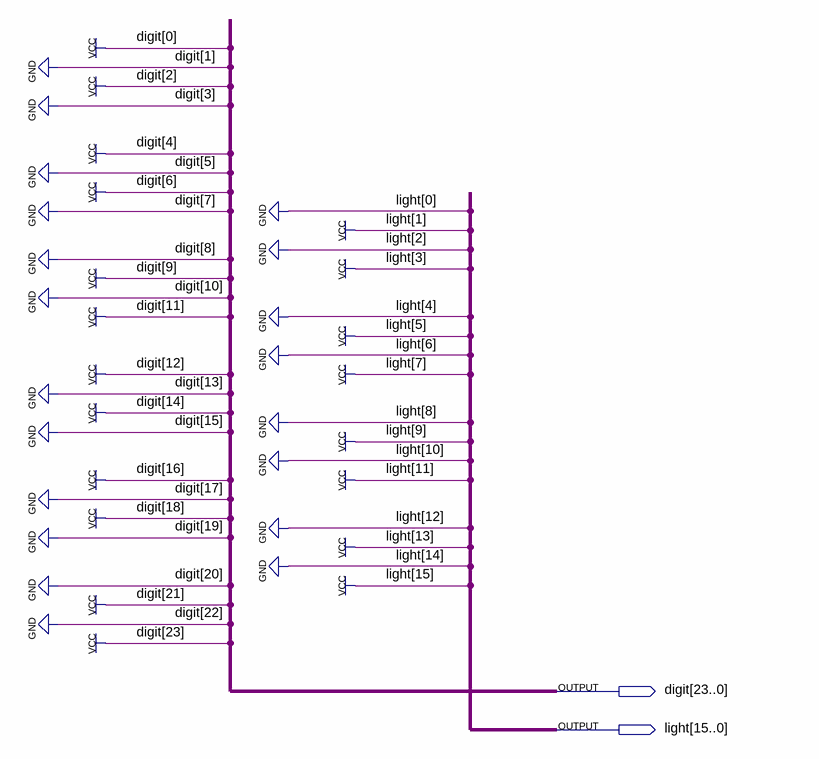
[diagram p0: schematic sheet]
// Quartus schematic Pattern_0_Frame_7.bdf as structural Verilog: 0 symbols, 2 pins
module Pattern_0_Frame_7 (
  output [23:0] digit,
  output [15:0] light
);


  assign digit = 24'b101001010101101001010101;
  assign light = 16'b1010101010101010;
endmodule
